# EAGLE design slave (EAGLE 6.5.0)
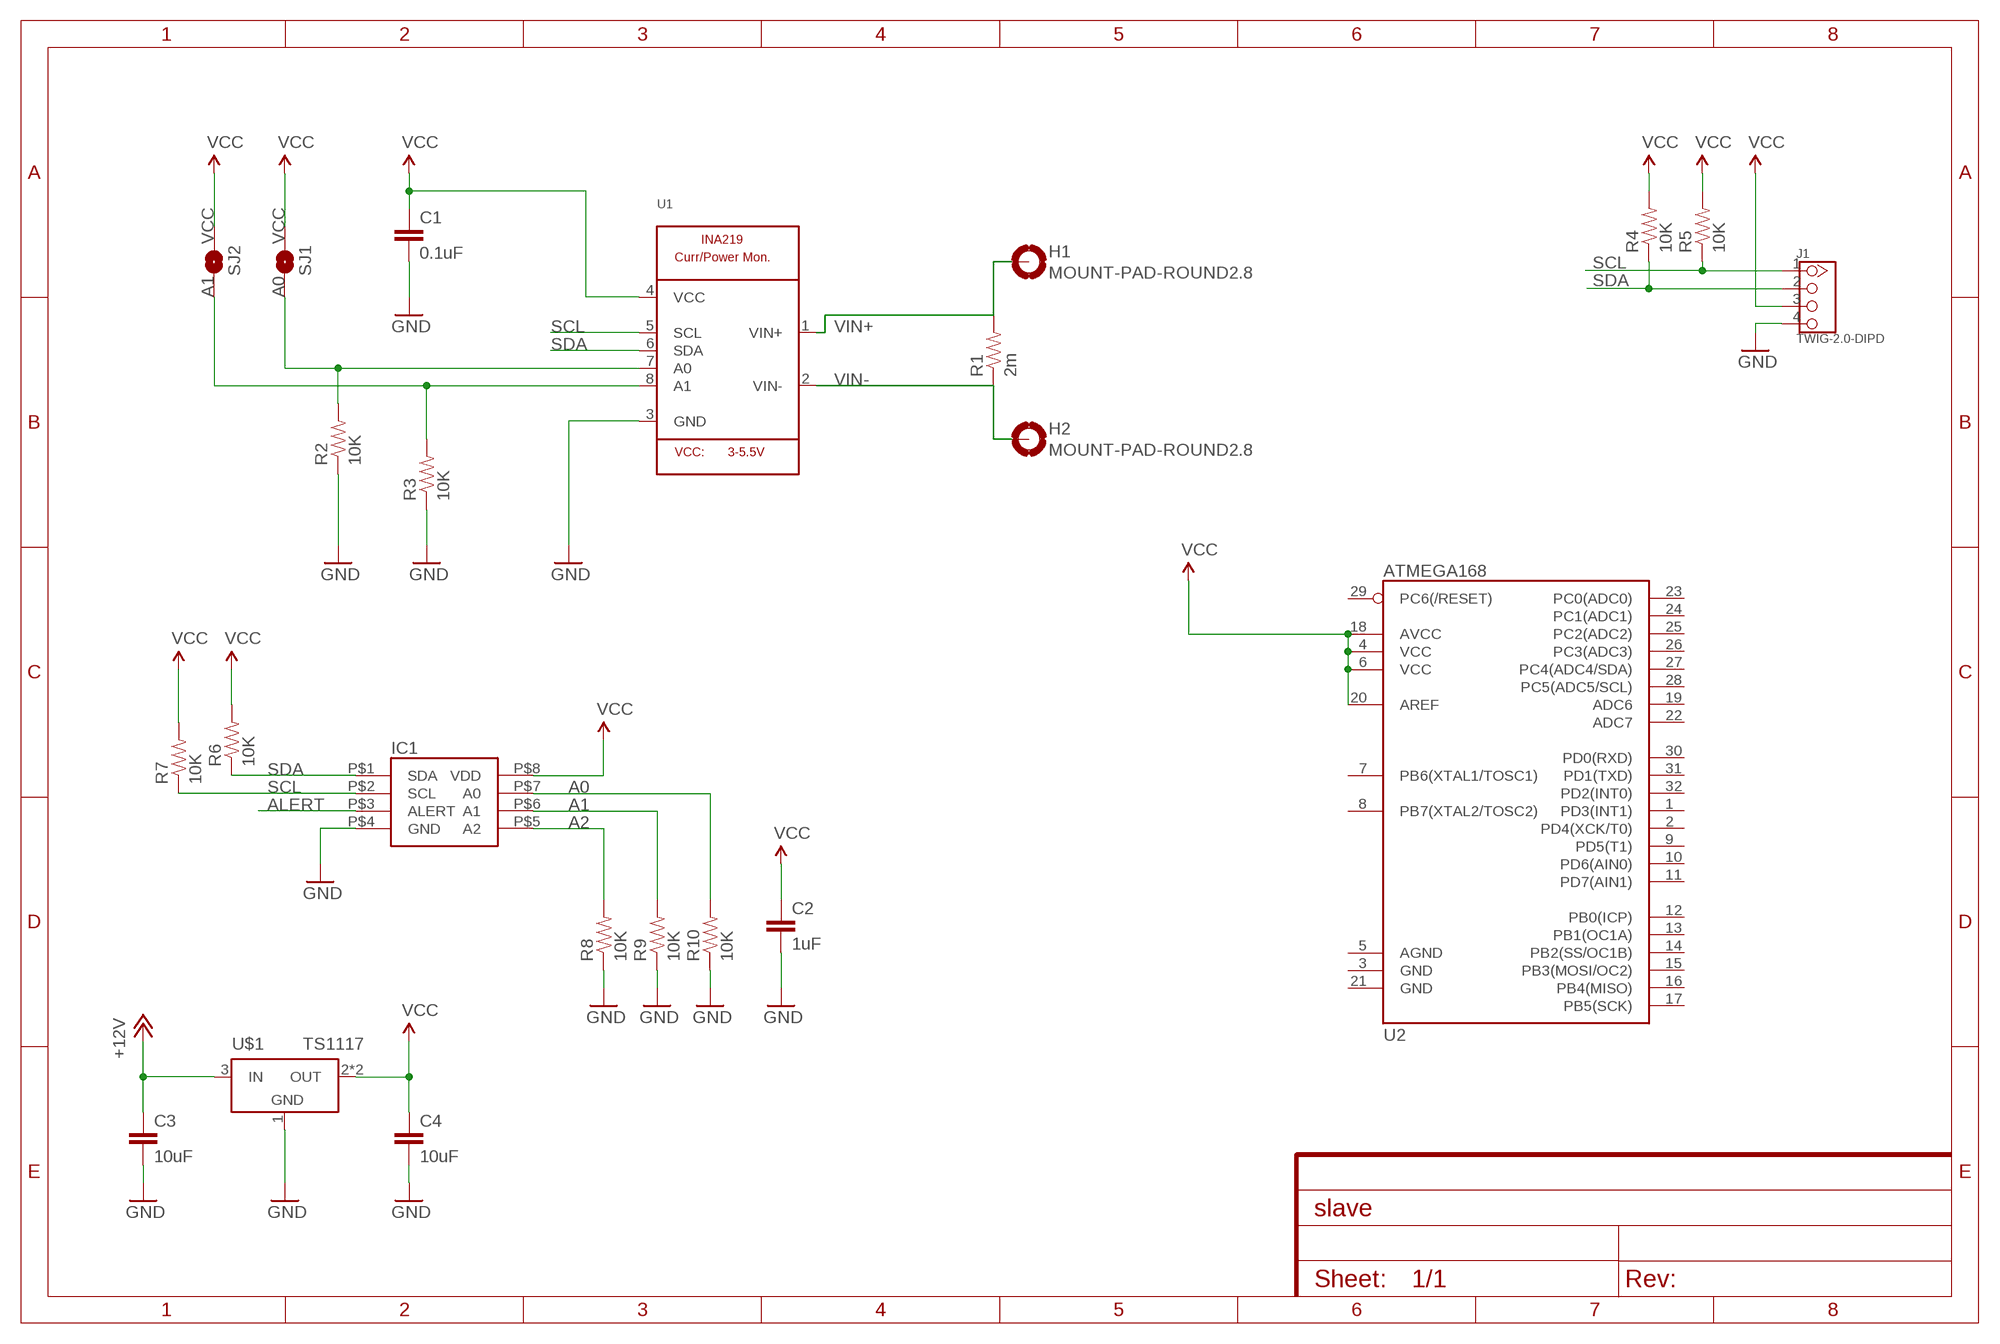
[diagram p0: schematic, sheet 1]

## Parts
C1  0.1uF  CAP0805  [0805]
C2  1uF  CAP0805  [0805]
C3  10uF  CAP0805  [0805]
C4  10uF  CAP0805  [0805]
H1  MOUNT-PAD-ROUND2.8  [2,8-PAD]
H2  MOUNT-PAD-ROUND2.8  [2,8-PAD]
IC1  MPC9804  [MSOP-8]
J1  TWIG-2.0-DIPD  [2.0_1X4_90]
R1  2m  RESISTOR2512  [R2512]
R2  10K  RESISTOR0805-RES  [0805]
R3  10K  RESISTOR0805-RES  [0805]
R4  10K  RESISTOR0805-RES  [0805]
R5  10K  RESISTOR0805-RES  [0805]
R6  10K  RESISTOR0805-RES  [0805]
R7  10K  RESISTOR0805-RES  [0805]
R8  10K  RESISTOR0805-RES  [0805]
R9  10K  RESISTOR0805-RES  [0805]
R10  10K  RESISTOR0805-RES  [0805]
SJ1  SOLDERJUMPERNO  [SJ_2S-NO]
SJ2  SOLDERJUMPERNO  [SJ_2S-NO]
U1  INA219  [SOT23-8]
U2  ATMEGA168  [TQFP32-08]
U$1  TS1117  [SOT223]

## Nets
+12V: C3.1 U$1.3(IN)
A0: IC1.P$7(A0) R2.2 R10.2 SJ1.1 U1.7(A0)
A1: IC1.P$6(A1) R3.2 R9.2 SJ2.1 U1.8(A1)
A2: IC1.P$5(A2) R8.2
ALERT: IC1.P$3(ALERT)
GND: C1.2 C2.2 C3.2 C4.2 IC1.P$4(GND) J1.4 R2.1 R3.1 R8.1 R9.1 R10.1 U1.3(GND) U$1.1(GND)
SCL: IC1.P$2(SCL) J1.1 R5.1 R7.1 U1.5(SCL)
SDA: IC1.P$1(SDA) J1.2 R4.1 R6.1 U1.6(SDA)
VCC: C1.1 C2.1 C4.1 IC1.P$8(VDD) J1.3 R4.2 R5.2 R6.2 R7.2 SJ1.2 SJ2.2 U1.4(VCC) U2.4(VCC) U2.6(VCC) U2.18(AVCC) U2.20(AREF) U$1.2(OUT) U$1.4(OUT)
VIN+: H1.B2,8(MOUNT) R1.2 U1.1(VIN+)
VIN-: H2.B2,8(MOUNT) R1.1 U1.2(VIN-)
Unconnected: U2.1(PD3(INT1)) U2.2(PD4(XCK/T0)) U2.3(GND) U2.5(AGND) U2.7(PB6(XTAL1/TOSC1)) U2.8(PB7(XTAL2/TOSC2)) U2.9(PD5(T1)) U2.10(PD6(AIN0)) U2.11(PD7(AIN1)) U2.12(PB0(ICP)) U2.13(PB1(OC1A)) U2.14(PB2(SS/OC1B)) U2.15(PB3(MOSI/OC2)) U2.16(PB4(MISO)) U2.17(PB5(SCK)) U2.19(ADC6) U2.21(GND) U2.22(ADC7) U2.23(PC0(ADC0)) U2.24(PC1(ADC1)) U2.25(PC2(ADC2)) U2.26(PC3(ADC3)) U2.27(PC4(ADC4/SDA)) U2.28(PC5(ADC5/SCL)) U2.29(PC6(/RESET)) U2.30(PD0(RXD)) U2.31(PD1(TXD)) U2.32(PD2(INT0))

## Library data of the parts
C1-C4 = SparkFun-Passives:CAP: Capacitor Standard 0603 ceramic capacitor, and 0.1" leaded capacitor.
H1 H2 = holes:MOUNT-PAD-ROUND: MOUNTING PAD, round
IC1 = MCP9804:MPC9804
J1 = Connector:TWIG-2.0-DIP
R1-R10 = SparkFun-Passives:RESISTOR: Resistor Basic schematic elements and footprints for 0603, 1206, and PTH resistors.
SJ1 SJ2 = SparkFun-Passives:SOLDERJUMPER: Solder Jumper Standard SMD solder jumper. Used to automate production. Two varients : Normally Open and Normally Closed are the same, but have different paste layers. NC will have a large amount of paste and should jumper during reflow.
U1 = microbuilder:INA219: INA219 - I2C Current/Power Monitor Voltage Range: 0-26V Accuracy: 0.5% Temperature: -40°C - 125°C
U2 = SparkFun-DigitalIC:ATMEGA168: Atmel 32-pin 8-bit micro, 16k flash.
U$1 = MeineLIB:TS1117

## Board
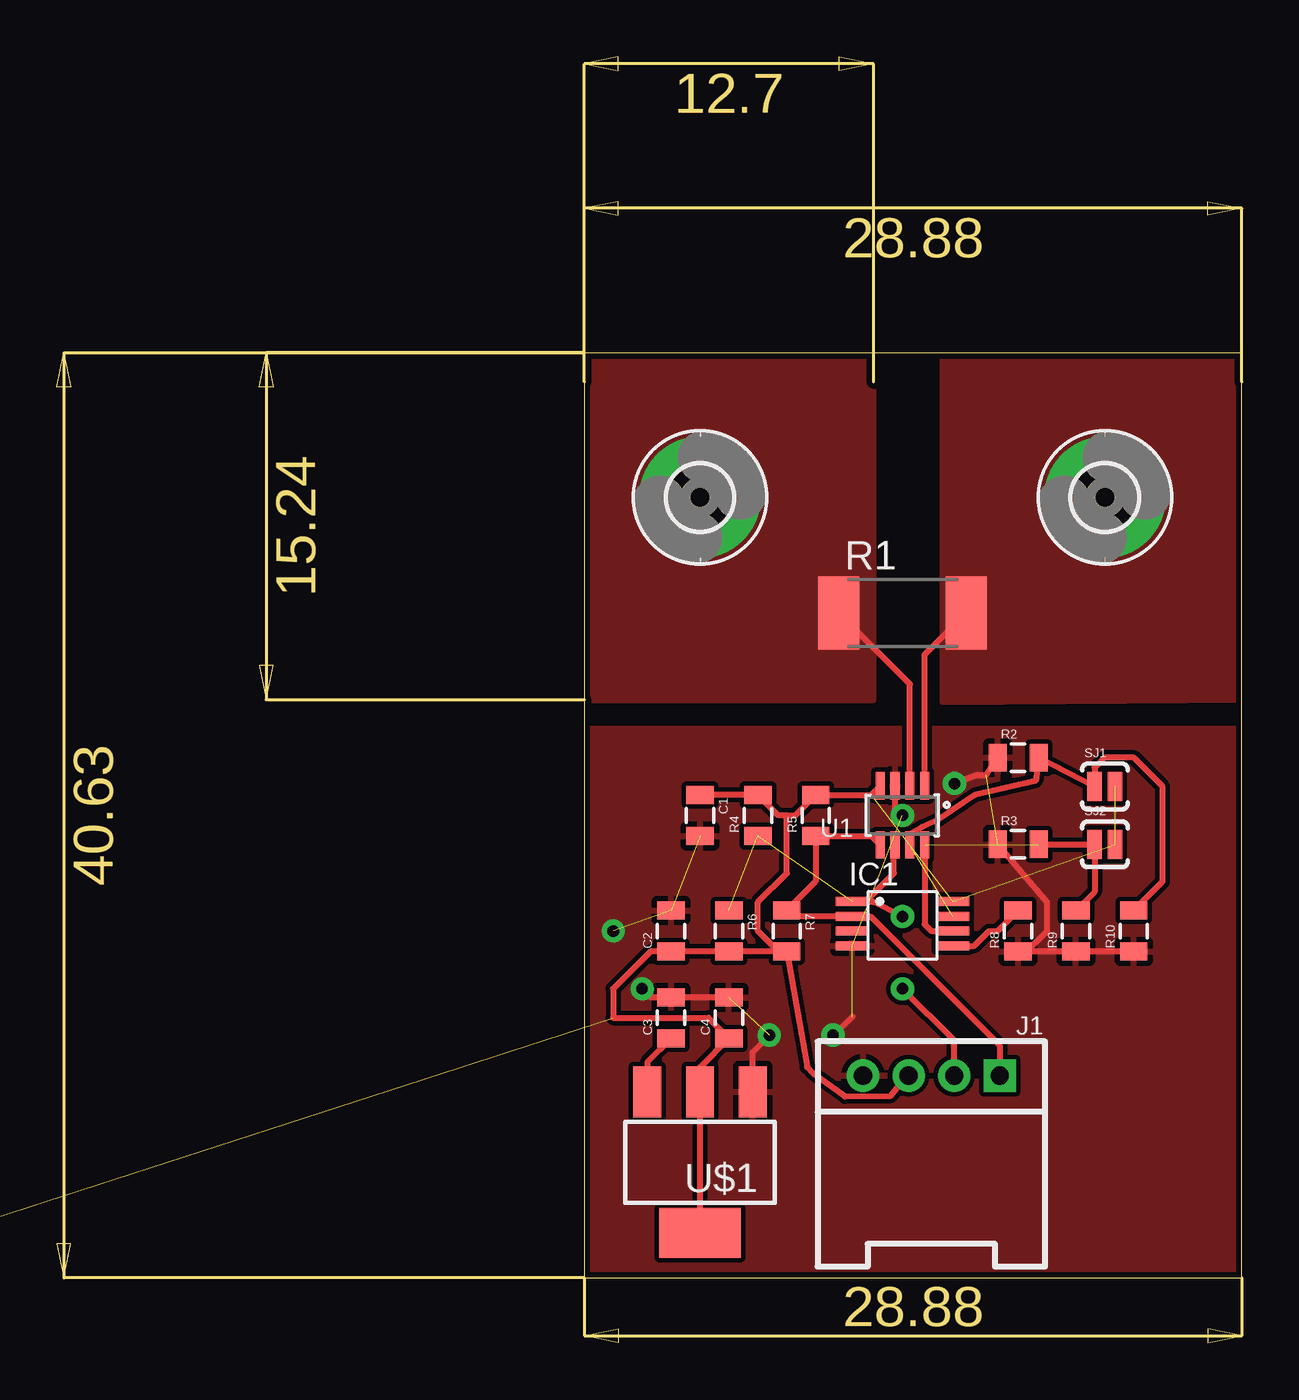
[diagram p1: board, top side]
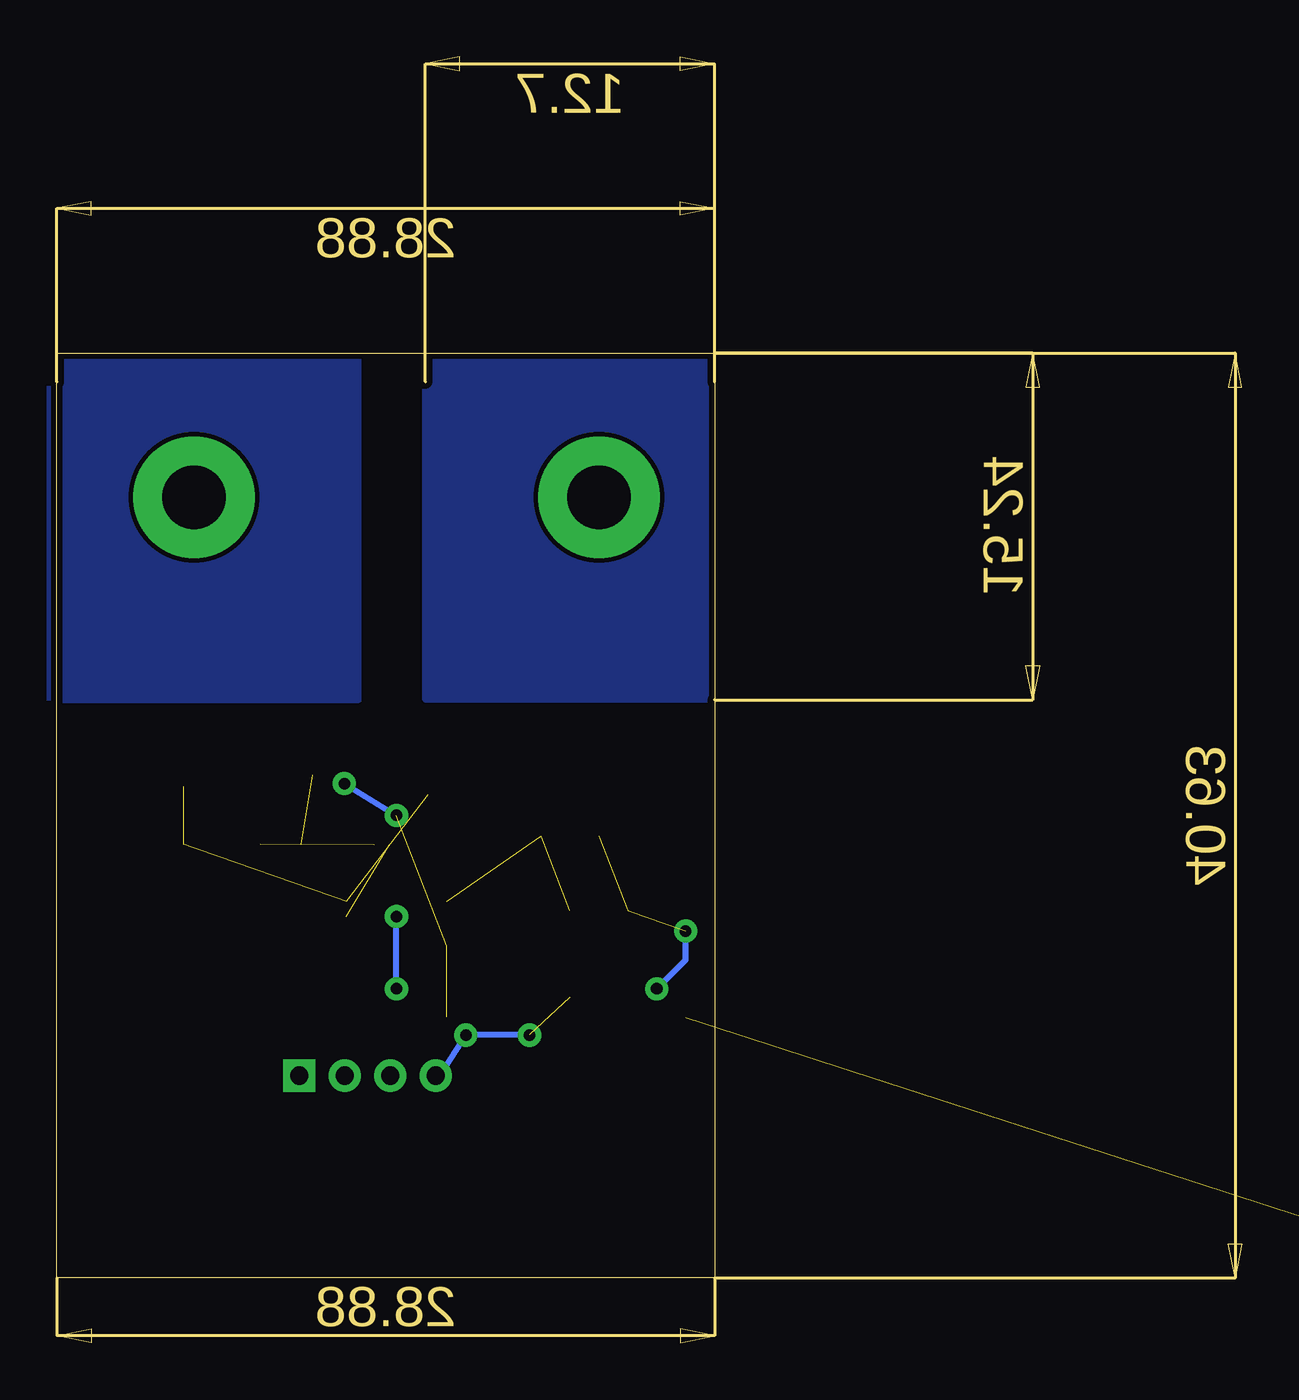
[diagram p2: board, bottom side, seen from below]

Size 28.88 x 40.63 mm. Coordinates in mm from the lower left corner, seen from the top.
Outline: 0,0 28.88,0 28.88,40.63 0,40.63 0,0
Copper layers (1*16): Top 0.035mm / dielectric 1.5mm / Bottom 0.035mm
Design rules "SparkFun": minimum track width 8mil, minimum drill 20mil, track to track 8mil, track to pad 8mil, pad to pad 8mil, via to via 8mil, smd to smd 8mil, copper to edge 10mil, drill to drill 8mil, minimum pad ring 12mil, minimum via ring 10mil, stop-mask expansion 4mil, vias tented up to drill 25mil, thermal gap 10mil

### Footprints (pad centres in the part's own frame; a part is rotated, then mirrored left to right if it is on the bottom)
0805 = smd 0.8 x 1.2: 1 -0.9,0; 2 0.9,0
2,8-PAD = drill 2.8 pad 5.334: B2,8 0,0
MSOP-8 = smd 1.45 x 0.4: P$1 -2.2,1.3; P$2 -2.2,0.65; P$3 -2.2,0; P$4 -2.2,-0.65; P$5 2.2,-0.65; P$6 2.2,0; P$7 2.2,0.65; P$8 2.2,1.3
2.0_1X4_90 = drill 0.8 pad 1.27 square: 1 -3,0 | drill 0.8 pad 1.27: 2 -1,0; 3 1,0; 4 3,0
R2512 = smd 1.8 x 3.2: 1 -2.8,0; 2 2.8,0
SJ_2S-NO = smd 0.635 x 1.27: 1 -0.45,0; 2 0.45,0
SOT23-8 = smd 0.4 x 1.2: 1 -0.975,-1.3; 2 -0.325,-1.3; 3 0.325,-1.3; 4 0.975,-1.3; 5 0.975,1.3; 6 0.325,1.3; 7 -0.325,1.3; 8 -0.975,1.3
TQFP32-08 = smd 1.27 x 0.559: 1 -4.293,2.8; 2 -4.293,2; 3 -4.293,1.2; 4 -4.293,0.4; 5 -4.293,-0.4; 6 -4.293,-1.2; 7 -4.293,-2; 8 -4.293,-2.8; 17 4.293,-2.8; 18 4.293,-2; 19 4.293,-1.2; 20 4.293,-0.4; 21 4.293,0.4; 22 4.293,1.2; 23 4.293,2; 24 4.293,2.8 | smd 0.559 x 1.27: 9 -2.8,-4.293; 10 -2,-4.293; 11 -1.2,-4.293; 12 -0.4,-4.293; 13 0.4,-4.293; 14 1.2,-4.293; 15 2,-4.293; 16 2.8,-4.293; 25 2.8,4.293; 26 2,4.293; 27 1.2,4.293; 28 0.4,4.293; 29 -0.4,4.293; 30 -1.2,4.293; 31 -2,4.293; 32 -2.8,4.293
SOT223 = smd 1.219 x 2.235: 1 -2.311,-3.099; 2 0,-3.099; 3 2.311,-3.099 | smd 3.6 x 2.2: 4 0,3.099

### Placement (x,y rotation side)
C1  5.08,20.32 270 top
C2  3.81,15.24 90 top
C3  3.81,11.43 90 top
C4  6.35,11.43 90 top
H1  22.86,34.29 0 top
H2  5.08,34.29 0 top
IC1  13.97,15.24 0 top
J1  15.24,8.89 180 top
R1  13.97,29.21 0 top
R2  19.05,22.86 0 top
R3  19.05,19.05 0 top
R4  7.62,20.32 90 top
R5  10.16,20.32 90 top
R6  6.35,15.24 270 top
R7  8.89,15.24 270 top
R8  19.05,15.24 90 top
R9  21.59,15.24 90 top
R10  24.13,15.24 90 top
SJ1  22.86,21.59 0 top
SJ2  22.86,19.05 0 top
U1  13.97,20.32 180 top
U2  -31.75,2.54 0 top  (outside the outline)
U$1  5.08,5.08 180 top

### Tracks (layer width: path | path; a pad name or v marks a point on that pad's centre or on a via)
+12V
  Top 0.254: C3.1 2.77,9.49 U$1.3
A0  (1 unrouted)
  Top 0.254: R10.2 25.4,17.41 25.4,21.59 24.13,22.86 22.86,22.86 22.41,22.41 SJ1.1 R2.2 19.82,21.83 17.14,21.21 15.62,20.19 14.86,19.81 14.29,19.5 U1.7
A1  (1 unrouted)
  Top 0.254: R3.2 SJ2.1 22.41,16.96 R9.2 | U1.8 14.95,15.54 15.24,15.24 IC1.P$6
A2
  Top 0.254: IC1.P$5 17.13,14.59 17.78,15.24 18.15,15.24 R8.2
GND  (via drill 0.51)  (6 unrouted)
  Top 0.254: R10.1 R9.1 R8.1 19.42,14.34 20.32,15.24 20.32,16.5 R3.1 | C4.2 C3.2 2.91,12.33 v2.54,12.7 | v16.26,21.72 17.27,22.1 17.65,22.1 R2.1 | v13.97,20.32 13.64,20.64 U1.3 | 11.77,11.47 v10.92,10.67 | U$1.1 7.39,9.93 v8.13,10.67
  Bottom 0.254: v2.54,12.7 1.27,13.97 v1.27,15.24 | v16.26,21.72 v13.97,20.32 | J1.4 11.81,9.32 v10.92,10.67 v8.13,10.67
  pour Top: 0,24.13 29.21,24.13 29.21,0 0,0
N$1
  pour Bottom: 12.7,25.4 12.7,40.64 0,40.64 0,25.4
N$2
  pour Bottom: 15.62,40.64 29.21,40.64 29.21,25.4 15.62,25.4
SCL
  Top 0.254: U1.5 12.6,19.42 R5.1 10.16,17.41 R7.1 9.14,15.89 IC1.P$2 11.79,15.88 12.57,15.88 18.24,10.21 J1.1
SDA  (via drill 0.51)  (2 unrouted)
  Top 0.254: J1.2 16.24,10.43 v13.97,12.7 | v13.97,15.88 12.7,16.51 11.8,16.51 IC1.P$1 12.35,16.54 13.59,17.78 13.59,18.96 U1.6
  Bottom 0.254: v13.97,12.7 v13.97,15.88
VCC  (7 unrouted)
  Top 0.254: U$1.4 U$1.2 5.08,9.26 C4.1 5.45,11.43 1.27,11.43 1.27,12.7 2.91,14.34 R6.2 | R7.2 R6.2 | R6.2 C2.1 | R7.2 8.52,14.34 7.62,15.24 7.62,16.51 8.89,17.78 8.89,20.32 | 8.89,20.32 8.52,20.32 R4.2 C1.1 | 8.89,20.32 9.26,20.32 R5.2 12.6,21.22 U1.4 | R7.2 9.78,9.27 10.06,8.99 11.46,7.97 13.46,8 14.24,8.99 J1.3
VIN+
  Top 0.254: U1.1 14.95,27.39 R1.2
  pour Top (no thermals): 15.75,25.27 15.75,40.51 29.21,40.64 29.21,25.4
VIN-
  Top 0.254: U1.2 14.29,26.09 R1.1
  pour Top (no thermals): 0,25.4 12.7,25.4 12.7,40.64 0,40.64